# Altium project 100885_project.prjpcb
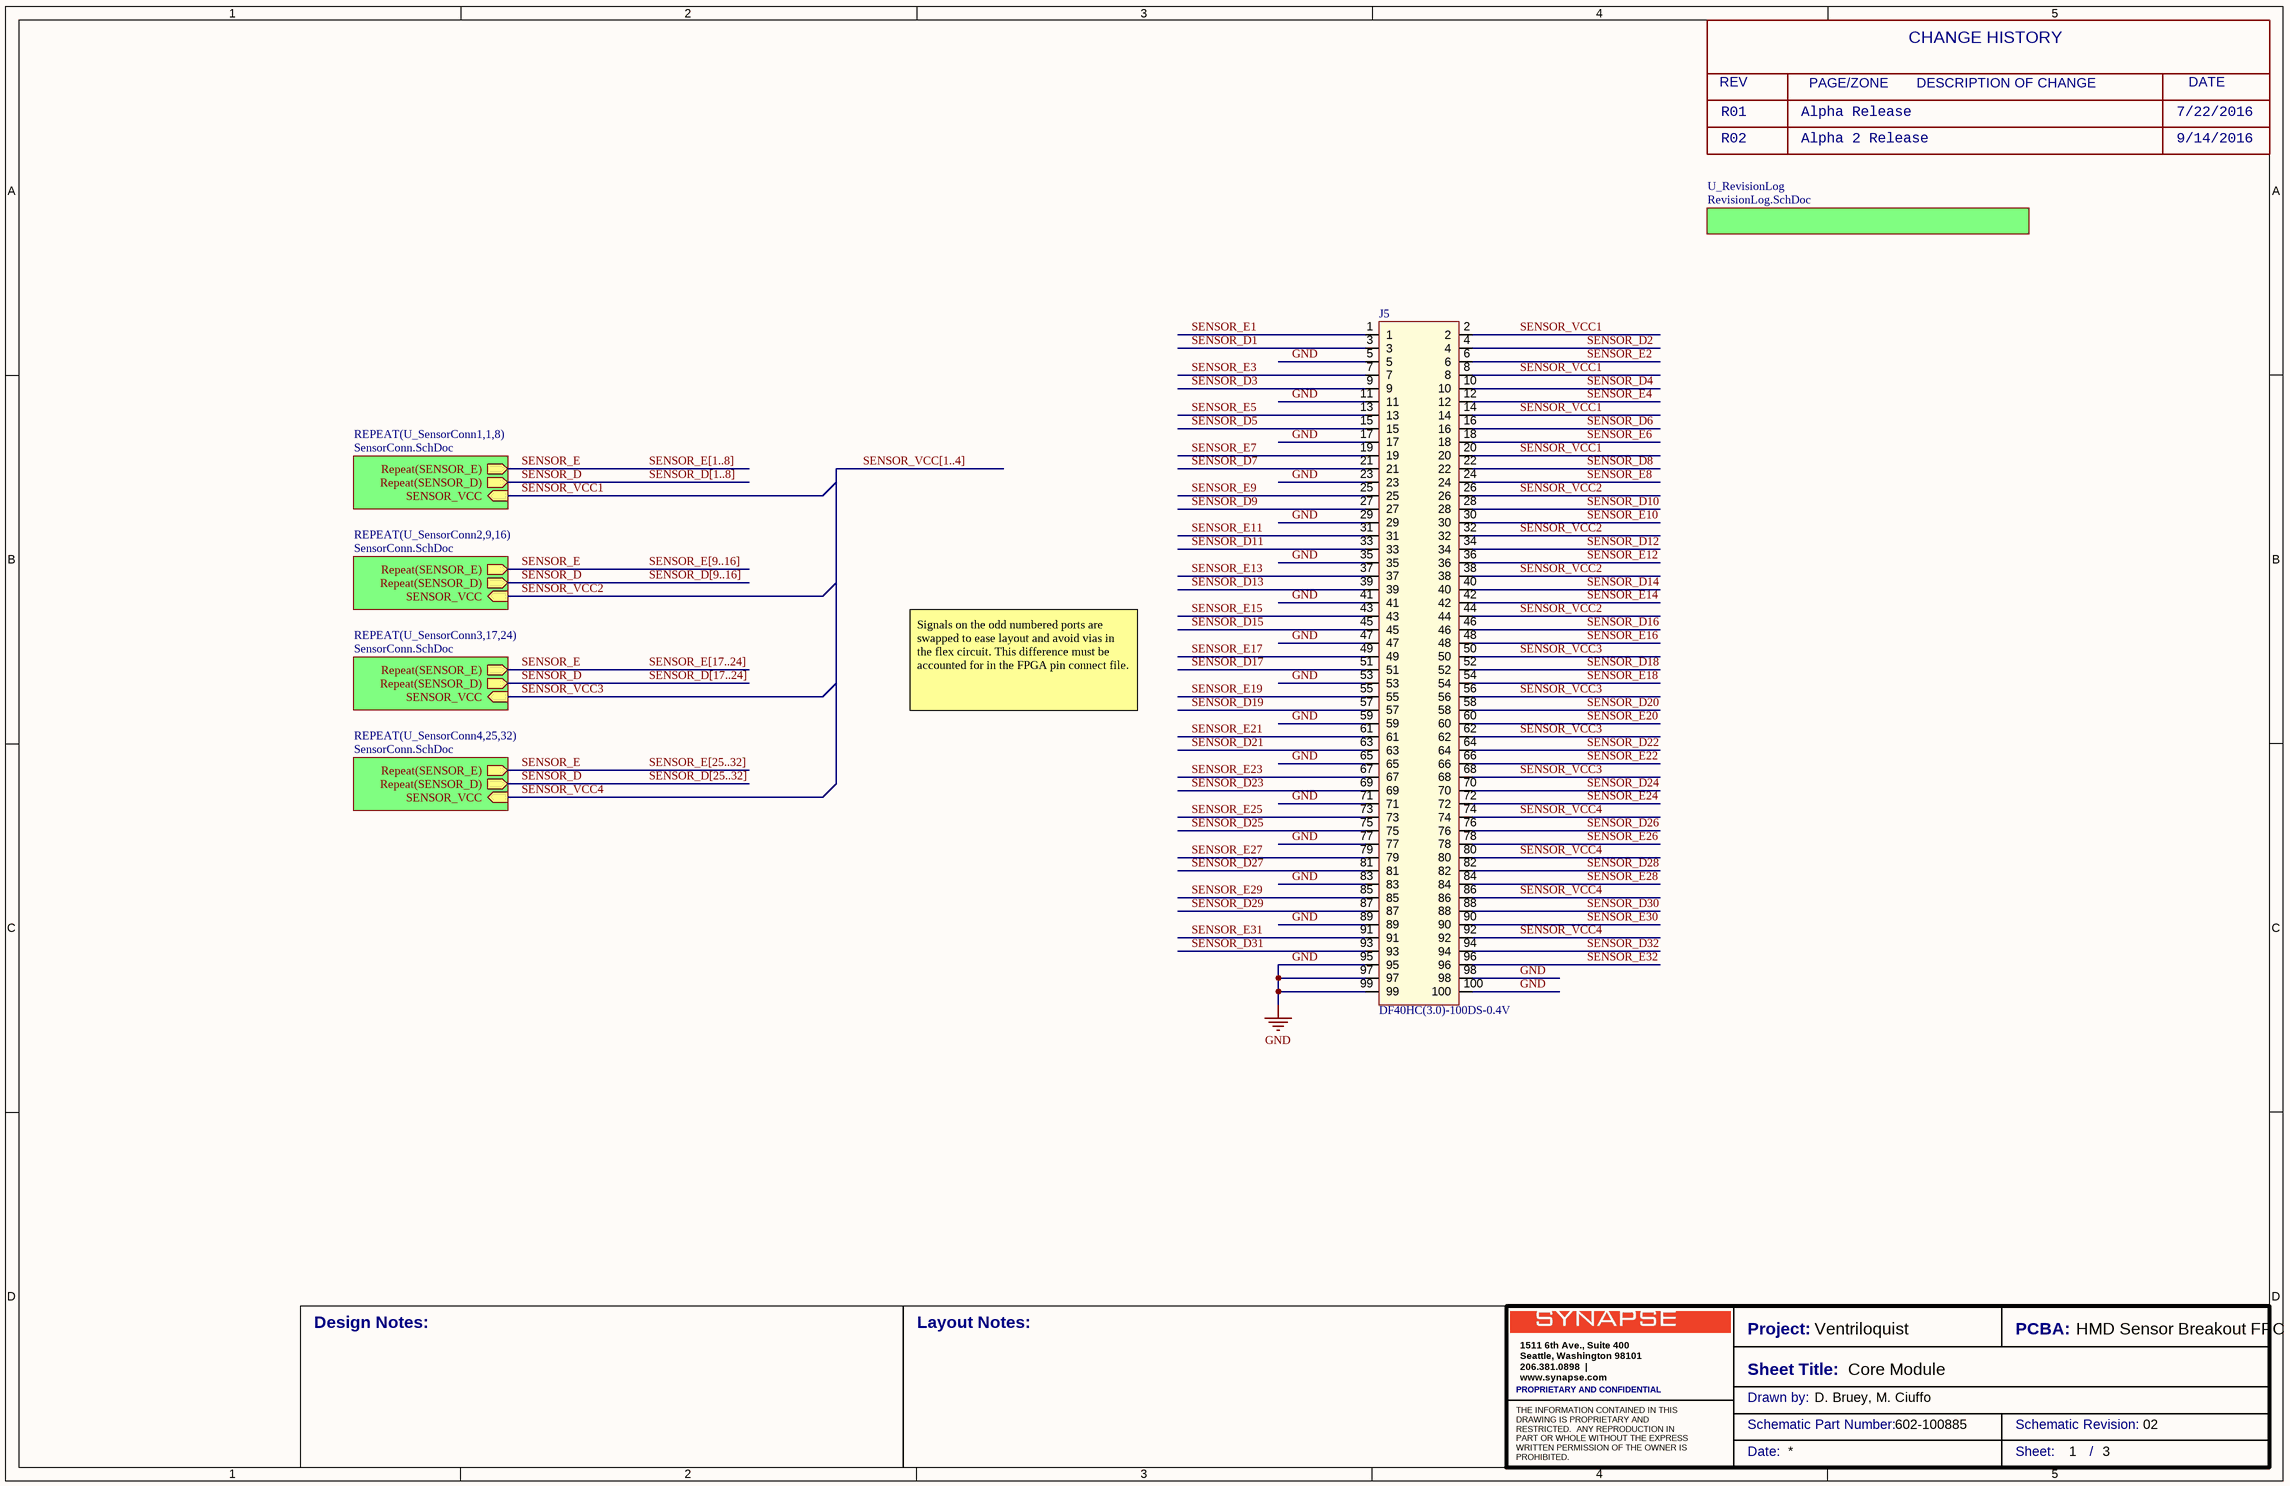
[diagram p0: SensorBreakout.SchDoc]
Sch_Revision: 02; Project_Name: Ventriloquist; PCB_Revision: 02; Board_Number: 100885; Board_Name: HMD Sensor Breakout FPC
3 sheets, 33 parts. Net scope: hierarchical (ports join the sheet entries above them; power ports are global).
Board file: 100885.PcbDoc
Sheets:
  SensorBreakout.SchDoc
    U_SensorConn11 = SensorConn.SchDoc
    U_SensorConn12 = SensorConn.SchDoc
    U_SensorConn13 = SensorConn.SchDoc
    U_SensorConn14 = SensorConn.SchDoc
    U_SensorConn15 = SensorConn.SchDoc
    U_SensorConn16 = SensorConn.SchDoc
    U_SensorConn17 = SensorConn.SchDoc
    U_SensorConn18 = SensorConn.SchDoc
    U_SensorConn29 = SensorConn.SchDoc
    U_SensorConn210 = SensorConn.SchDoc
    U_SensorConn211 = SensorConn.SchDoc
    U_SensorConn212 = SensorConn.SchDoc
    U_SensorConn213 = SensorConn.SchDoc
    U_SensorConn214 = SensorConn.SchDoc
    U_SensorConn215 = SensorConn.SchDoc
    U_SensorConn216 = SensorConn.SchDoc
    U_SensorConn317 = SensorConn.SchDoc
    U_SensorConn318 = SensorConn.SchDoc
    U_SensorConn319 = SensorConn.SchDoc
    U_SensorConn320 = SensorConn.SchDoc
    U_SensorConn321 = SensorConn.SchDoc
    U_SensorConn322 = SensorConn.SchDoc
    U_SensorConn323 = SensorConn.SchDoc
    U_SensorConn324 = SensorConn.SchDoc
    U_SensorConn425 = SensorConn.SchDoc
    U_SensorConn426 = SensorConn.SchDoc
    U_SensorConn427 = SensorConn.SchDoc
    U_SensorConn428 = SensorConn.SchDoc
    U_SensorConn429 = SensorConn.SchDoc
    U_SensorConn430 = SensorConn.SchDoc
    U_SensorConn431 = SensorConn.SchDoc
    U_SensorConn432 = SensorConn.SchDoc
    U_RevisionLog = RevisionLog.SchDoc

## Sheet SensorBreakout.SchDoc: Core Module
size 431 x 279 mm; DrawnBy: D. Bruey, M. Ciuffo; Organization: Synapse Product Development, LLC.; Address1: 1511 6th Ave., Suite 400; Address2: Seattle, Washington 98101; Address3: 206.381.0898; Address4: www.synapse.com; DocumentNumber: 1; SheetNumber: 1; SheetTotal: 3; PageSetup: Record=PageOptions|CenterHorizontal=True|CenterVertical=True|PrintScale=1.06|XCorrection=1.00|YCorrection=1.00|PrintKind=1|BorderSize=5000000|LeftOffset=0|BottomOffset=0|Orientation=2|PaperLength=4318|PaperWidth=2794|Scale=100|PaperSource=7|PrintQuality=200|MediaType=1|DitherType=10|PrintScaleMode=1|PaperKind=11x17|PaperIndex=3

### Parts
J5  DF40HC(3.0)-100DS-0.4V  [con100_hirose-df40c-100ds_129h]

### Sub-sheets
REPEAT(U_SensorConn1,1,8) = SensorConn.SchDoc: Repeat(SENSOR_D), Repeat(SENSOR_E), SENSOR_VCC (in)
REPEAT(U_SensorConn2,9,16) = SensorConn.SchDoc: Repeat(SENSOR_D), Repeat(SENSOR_E), SENSOR_VCC (in)
REPEAT(U_SensorConn3,17,24) = SensorConn.SchDoc: Repeat(SENSOR_D), Repeat(SENSOR_E), SENSOR_VCC (in)
REPEAT(U_SensorConn4,25,32) = SensorConn.SchDoc: Repeat(SENSOR_D), Repeat(SENSOR_E), SENSOR_VCC (in)
U_RevisionLog = RevisionLog.SchDoc: no entries

### Nets
GND: J5.5 J5.11 J5.17 J5.23 J5.29 J5.35 J5.41 J5.47 J5.53 J5.59 J5.65 J5.71 J5.77 J5.83 J5.89 J5.95 J5.97 J5.98 J5.99 J5.100
SENSOR_D: sheet REPEAT(U_SensorConn1,1,8)/Repeat(SENSOR_D), sheet REPEAT(U_SensorConn2,9,16)/Repeat(SENSOR_D), sheet REPEAT(U_SensorConn3,17,24)/Repeat(SENSOR_D), sheet REPEAT(U_SensorConn4,25,32)/Repeat(SENSOR_D)
SENSOR_D1: J5.3
SENSOR_D2: J5.4
SENSOR_D3: J5.9
SENSOR_D4: J5.10
SENSOR_D5: J5.15
SENSOR_D6: J5.16
SENSOR_D7: J5.21
SENSOR_D8: J5.22
SENSOR_D9: J5.27
SENSOR_D10: J5.28
SENSOR_D11: J5.33
SENSOR_D12: J5.34
SENSOR_D13: J5.39
SENSOR_D14: J5.40
SENSOR_D15: J5.45
SENSOR_D16: J5.46
SENSOR_D17: J5.51
SENSOR_D18: J5.52
SENSOR_D19: J5.57
SENSOR_D20: J5.58
SENSOR_D21: J5.63
SENSOR_D22: J5.64
SENSOR_D23: J5.69
SENSOR_D24: J5.70
SENSOR_D25: J5.75
SENSOR_D26: J5.76
SENSOR_D27: J5.81
SENSOR_D28: J5.82
SENSOR_D29: J5.87
SENSOR_D30: J5.88
SENSOR_D31: J5.93
SENSOR_D32: J5.94
SENSOR_E: sheet REPEAT(U_SensorConn1,1,8)/Repeat(SENSOR_E), sheet REPEAT(U_SensorConn2,9,16)/Repeat(SENSOR_E), sheet REPEAT(U_SensorConn3,17,24)/Repeat(SENSOR_E), sheet REPEAT(U_SensorConn4,25,32)/Repeat(SENSOR_E)
SENSOR_E1: J5.1
SENSOR_E2: J5.6
SENSOR_E3: J5.7
SENSOR_E4: J5.12
SENSOR_E5: J5.13
SENSOR_E6: J5.18
SENSOR_E7: J5.19
SENSOR_E8: J5.24
SENSOR_E9: J5.25
SENSOR_E10: J5.30
SENSOR_E11: J5.31
SENSOR_E12: J5.36
SENSOR_E13: J5.37
SENSOR_E14: J5.42
SENSOR_E15: J5.43
SENSOR_E16: J5.48
SENSOR_E17: J5.49
SENSOR_E18: J5.54
SENSOR_E19: J5.55
SENSOR_E20: J5.60
SENSOR_E21: J5.61
SENSOR_E22: J5.66
SENSOR_E23: J5.67
SENSOR_E24: J5.72
SENSOR_E25: J5.73
SENSOR_E26: J5.78
SENSOR_E27: J5.79
SENSOR_E28: J5.84
SENSOR_E29: J5.85
SENSOR_E30: J5.90
SENSOR_E31: J5.91
SENSOR_E32: J5.96
SENSOR_VCC1: J5.2 J5.8 J5.14 J5.20 ; sheet REPEAT(U_SensorConn1,1,8)/SENSOR_VCC
SENSOR_VCC2: J5.26 J5.32 J5.38 J5.44 ; sheet REPEAT(U_SensorConn2,9,16)/SENSOR_VCC
SENSOR_VCC3: J5.50 J5.56 J5.62 J5.68 ; sheet REPEAT(U_SensorConn3,17,24)/SENSOR_VCC
SENSOR_VCC4: J5.74 J5.80 J5.86 J5.92 ; sheet REPEAT(U_SensorConn4,25,32)/SENSOR_VCC

### Buses and harness runs
bus SENSOR_D[1..8]
bus SENSOR_D[9..16]
bus SENSOR_D[17..24]
bus SENSOR_D[25..32]
bus SENSOR_E[1..8]
bus SENSOR_E[9..16]
bus SENSOR_E[17..24]
bus SENSOR_E[25..32]
bus SENSOR_VCC[1..4]

### Notes on the sheet
- REV
- PAGE/ZONE       DESCRIPTION OF CHANGE
- CHANGE HISTORY
- DATE
- R01
- R02
- Alpha Release
- Alpha 2 Release
- 7/22/2016
- 9/14/2016
- Signals on the odd numbered ports are swapped to ease layout and avoid vias in the flex circuit. This difference must be accounted for in the FPGA pin connect file.
- Design Notes:
- Layout Notes:
- Project:
- Sheet Title:
- PCBA:
- PROPRIETARY AND CONFIDENTIAL
- Drawn by:
- Schematic Part Number:
- Schematic Revision:
- Date:
- Sheet:
- /

### Library data of the parts
J5 = DF40HC(3.0)-100DS-0.4V(51): CONN RCPT 100POS 0.4MM SMD GOLD 3.0MM; part_type: connector; id: 1590; mfg: Hirose; dist: Mouser; dist_pn: 798-DF40HC30100DS451; voltage: 30V; positions: 100; TableName: viewAltiumConnectors; mfg_pn: DF40HC(3.0)-100DS-0.4V(51); source_package: DF40HC(3.0)-100DS-0.4V(51); height: 3.0mm; status: Unknown; datasheet: http://www.hirose.co.jp/cataloge_hp/ed_DF40_20140305.pdf

## Sheet SensorConn.SchDoc: Sensor Connectors
size 431 x 279 mm; DrawnBy: D. Bruey, M. Ciuffo; Organization: Synapse Product Development, LLC.; Address1: 1511 6th Ave., Suite 400; Address2: Seattle, Washington 98101; Address3: 206.381.0898; Address4: www.synapse.com; DocumentNumber: 2; SheetNumber: 2; SheetTotal: 3; PageSetup: Record=PageOptions|CenterHorizontal=True|CenterVertical=True|PrintScale=1.06|XCorrection=1.00|YCorrection=1.00|PrintKind=1|BorderSize=5000000|LeftOffset=0|BottomOffset=0|Orientation=2|PaperLength=4318|PaperWidth=2794|Scale=100|PaperSource=7|PrintQuality=200|MediaType=1|DitherType=10|PrintScaleMode=1|PaperKind=11x17|PaperIndex=3
Used 32 times, as channels U_SensorConn11, U_SensorConn12, U_SensorConn13, U_SensorConn14, U_SensorConn15, U_SensorConn16, U_SensorConn17, U_SensorConn18, U_SensorConn29, U_SensorConn210, U_SensorConn211, U_SensorConn212, U_SensorConn213, U_SensorConn214, U_SensorConn215, U_SensorConn216, U_SensorConn317, U_SensorConn318, U_SensorConn319, U_SensorConn320, U_SensorConn321, U_SensorConn322, U_SensorConn323, U_SensorConn324, U_SensorConn425, U_SensorConn426, U_SensorConn427, U_SensorConn428, U_SensorConn429, U_SensorConn430, U_SensorConn431, U_SensorConn432. Parts and nets are listed once, with the designators drawn on the sheet.
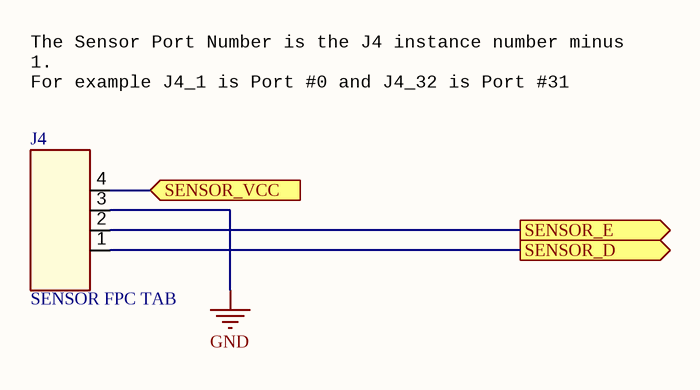
[diagram p1: SensorConn.SchDoc]

### Parts
J4  SENSOR FPC TAB  [WATCHMAN_CUSTOM_ZIF_4_PADS]  (no BOM)

### Ports
SENSOR_D (out), SENSOR_E (out), SENSOR_VCC (in)

### Nets
GND: J4.3
SENSOR_D: J4.1 ; port SENSOR_D
SENSOR_E: J4.2 ; port SENSOR_E
SENSOR_VCC: J4.4 ; port SENSOR_VCC

### Channels
U_SensorConn11: designators end in _1; ports SENSOR_D=SENSOR_D1 SENSOR_E=SENSOR_E1 SENSOR_VCC=SENSOR_VCC1
U_SensorConn12: designators end in _2; ports SENSOR_D=SENSOR_D2 SENSOR_E=SENSOR_E2 SENSOR_VCC=SENSOR_VCC1
U_SensorConn13: designators end in _3; ports SENSOR_D=SENSOR_D3 SENSOR_E=SENSOR_E3 SENSOR_VCC=SENSOR_VCC1
U_SensorConn14: designators end in _4; ports SENSOR_D=SENSOR_D4 SENSOR_E=SENSOR_E4 SENSOR_VCC=SENSOR_VCC1
U_SensorConn15: designators end in _5; ports SENSOR_D=SENSOR_D5 SENSOR_E=SENSOR_E5 SENSOR_VCC=SENSOR_VCC1
U_SensorConn16: designators end in _6; ports SENSOR_D=SENSOR_D6 SENSOR_E=SENSOR_E6 SENSOR_VCC=SENSOR_VCC1
U_SensorConn17: designators end in _7; ports SENSOR_D=SENSOR_D7 SENSOR_E=SENSOR_E7 SENSOR_VCC=SENSOR_VCC1
U_SensorConn18: designators end in _8; ports SENSOR_D=SENSOR_D8 SENSOR_E=SENSOR_E8 SENSOR_VCC=SENSOR_VCC1
U_SensorConn29: designators end in _9; ports SENSOR_D=SENSOR_D9 SENSOR_E=SENSOR_E9 SENSOR_VCC=SENSOR_VCC2
U_SensorConn210: designators end in _10; ports SENSOR_D=SENSOR_D10 SENSOR_E=SENSOR_E10 SENSOR_VCC=SENSOR_VCC2
U_SensorConn211: designators end in _11; ports SENSOR_D=SENSOR_D11 SENSOR_E=SENSOR_E11 SENSOR_VCC=SENSOR_VCC2
U_SensorConn212: designators end in _12; ports SENSOR_D=SENSOR_D12 SENSOR_E=SENSOR_E12 SENSOR_VCC=SENSOR_VCC2
U_SensorConn213: designators end in _13; ports SENSOR_D=SENSOR_D13 SENSOR_E=SENSOR_E13 SENSOR_VCC=SENSOR_VCC2
U_SensorConn214: designators end in _14; ports SENSOR_D=SENSOR_D14 SENSOR_E=SENSOR_E14 SENSOR_VCC=SENSOR_VCC2
U_SensorConn215: designators end in _15; ports SENSOR_D=SENSOR_D15 SENSOR_E=SENSOR_E15 SENSOR_VCC=SENSOR_VCC2
U_SensorConn216: designators end in _16; ports SENSOR_D=SENSOR_D16 SENSOR_E=SENSOR_E16 SENSOR_VCC=SENSOR_VCC2
U_SensorConn317: designators end in _17; ports SENSOR_D=SENSOR_D17 SENSOR_E=SENSOR_E17 SENSOR_VCC=SENSOR_VCC3
U_SensorConn318: designators end in _18; ports SENSOR_D=SENSOR_D18 SENSOR_E=SENSOR_E18 SENSOR_VCC=SENSOR_VCC3
U_SensorConn319: designators end in _19; ports SENSOR_D=SENSOR_D19 SENSOR_E=SENSOR_E19 SENSOR_VCC=SENSOR_VCC3
U_SensorConn320: designators end in _20; ports SENSOR_D=SENSOR_D20 SENSOR_E=SENSOR_E20 SENSOR_VCC=SENSOR_VCC3
U_SensorConn321: designators end in _21; ports SENSOR_D=SENSOR_D21 SENSOR_E=SENSOR_E21 SENSOR_VCC=SENSOR_VCC3
U_SensorConn322: designators end in _22; ports SENSOR_D=SENSOR_D22 SENSOR_E=SENSOR_E22 SENSOR_VCC=SENSOR_VCC3
U_SensorConn323: designators end in _23; ports SENSOR_D=SENSOR_D23 SENSOR_E=SENSOR_E23 SENSOR_VCC=SENSOR_VCC3
U_SensorConn324: designators end in _24; ports SENSOR_D=SENSOR_D24 SENSOR_E=SENSOR_E24 SENSOR_VCC=SENSOR_VCC3
U_SensorConn425: designators end in _25; ports SENSOR_D=SENSOR_D25 SENSOR_E=SENSOR_E25 SENSOR_VCC=SENSOR_VCC4
U_SensorConn426: designators end in _26; ports SENSOR_D=SENSOR_D26 SENSOR_E=SENSOR_E26 SENSOR_VCC=SENSOR_VCC4
U_SensorConn427: designators end in _27; ports SENSOR_D=SENSOR_D27 SENSOR_E=SENSOR_E27 SENSOR_VCC=SENSOR_VCC4
U_SensorConn428: designators end in _28; ports SENSOR_D=SENSOR_D28 SENSOR_E=SENSOR_E28 SENSOR_VCC=SENSOR_VCC4
U_SensorConn429: designators end in _29; ports SENSOR_D=SENSOR_D29 SENSOR_E=SENSOR_E29 SENSOR_VCC=SENSOR_VCC4
U_SensorConn430: designators end in _30; ports SENSOR_D=SENSOR_D30 SENSOR_E=SENSOR_E30 SENSOR_VCC=SENSOR_VCC4
U_SensorConn431: designators end in _31; ports SENSOR_D=SENSOR_D31 SENSOR_E=SENSOR_E31 SENSOR_VCC=SENSOR_VCC4
U_SensorConn432: designators end in _32; ports SENSOR_D=SENSOR_D32 SENSOR_E=SENSOR_E32 SENSOR_VCC=SENSOR_VCC4

### Notes on the sheet
- The Sensor Port Number is the J4 instance number minus 1.
  For example J4_1 is Port #0 and J4_32 is Port #31
- Design Notes:
- Layout Notes:
- Project:
- Sheet Title:
- PCBA:
- PROPRIETARY AND CONFIDENTIAL
- Drawn by:
- Schematic Part Number:
- Schematic Revision:
- Date:
- Sheet:
- /

### Library data of the parts
J4 = Watchman_Sensor_FPC_Tab: WATCHMAN SENSOR FPC TABS; part_type: connector; id: 1609; mfg: Custom; positions: 4; TableName: viewAltiumConnectors; mfg_pn: Watchman_Sensor_FPC_Tab; dist_pn: Watchman_Sensor_FPC_Tab; status: Unknown

## Sheet RevisionLog.SchDoc: Revision Log
size 431 x 279 mm; DrawnBy: D. Bruey, M. Ciuffo; Organization: Synapse Product Development, LLC.; Address1: 1511 6th Ave., Suite 400; Address2: Seattle, Washington 98101; Address3: 206.381.0898; Address4: www.synapse.com; DocumentNumber: 3; SheetNumber: 3; SheetTotal: 3; PageSetup: Record=PageOptions|CenterHorizontal=True|CenterVertical=True|PrintScale=1.06|XCorrection=1.00|YCorrection=1.00|PrintKind=1|BorderSize=5000000|LeftOffset=0|BottomOffset=0|Orientation=2|PaperLength=4318|PaperWidth=2794|Scale=100|PaperSource=7|PrintQuality=200|MediaType=1|DitherType=10|PrintScaleMode=1|PaperKind=11x17|PaperIndex=3
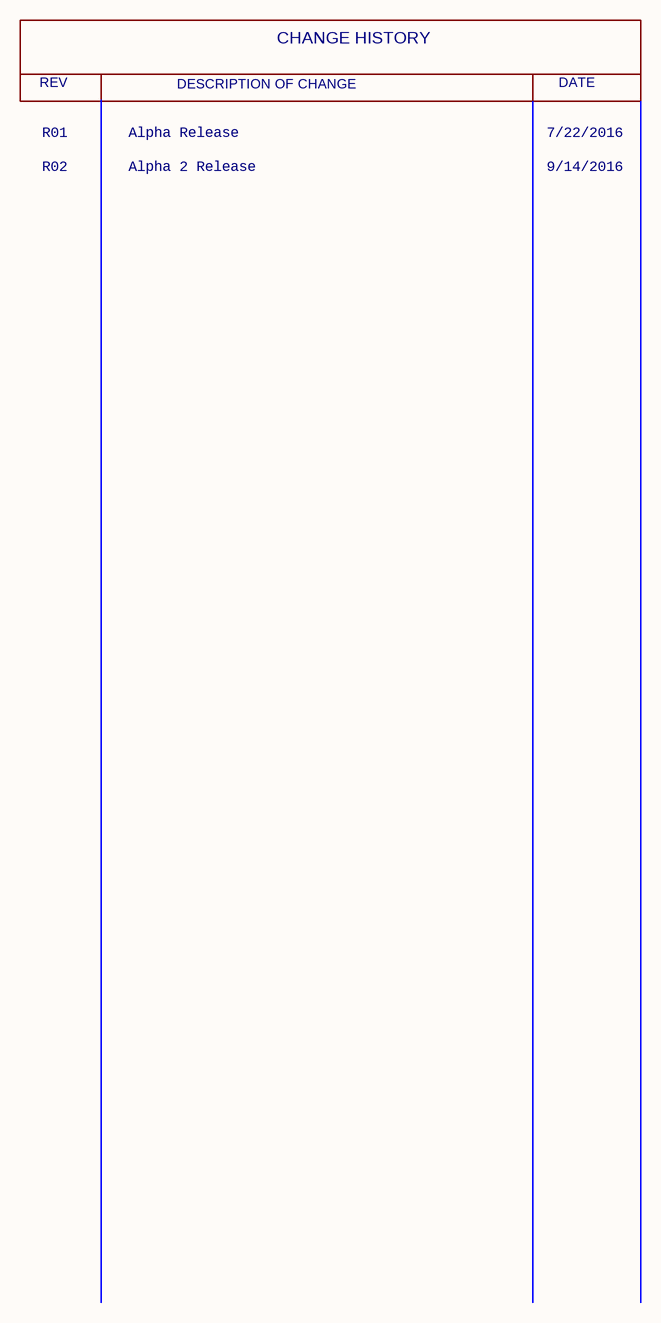
[diagram p2: RevisionLog.SchDoc]

### Notes on the sheet
- REV
- DESCRIPTION OF CHANGE
- CHANGE HISTORY
- DATE
- R01
- R02
- Alpha Release
- Alpha 2 Release
- 7/22/2016
- 9/14/2016
- Design Notes:
- Layout Notes:
- Project:
- Sheet Title:
- PCBA:
- PROPRIETARY AND CONFIDENTIAL
- Drawn by:
- Schematic Part Number:
- Schematic Revision:
- Date:
- Sheet:
- /

## Nets that join several sheets
GND: SensorBreakout (20 pins), U_SensorConn11 (J4_1.3), U_SensorConn12 (J4_2.3), U_SensorConn13 (J4_3.3), U_SensorConn14 (J4_4.3), U_SensorConn15 (J4_5.3), U_SensorConn16 (J4_6.3), U_SensorConn17 (J4_7.3), U_SensorConn18 (J4_8.3), U_SensorConn29 (J4_9.3), U_SensorConn210 (J4_10.3), U_SensorConn211 (J4_11.3), U_SensorConn212 (J4_12.3), U_SensorConn213 (J4_13.3), U_SensorConn214 (J4_14.3), U_SensorConn215 (J4_15.3), U_SensorConn216 (J4_16.3), U_SensorConn317 (J4_17.3), U_SensorConn318 (J4_18.3), U_SensorConn319 (J4_19.3), U_SensorConn320 (J4_20.3), U_SensorConn321 (J4_21.3), U_SensorConn322 (J4_22.3), U_SensorConn323 (J4_23.3), U_SensorConn324 (J4_24.3), U_SensorConn425 (J4_25.3), U_SensorConn426 (J4_26.3), U_SensorConn427 (J4_27.3), U_SensorConn428 (J4_28.3), U_SensorConn429 (J4_29.3), U_SensorConn430 (J4_30.3), U_SensorConn431 (J4_31.3), U_SensorConn432 (J4_32.3)
SENSOR_D1: SensorBreakout (J5.3), U_SensorConn11 (J4_1.1)
SENSOR_D2: SensorBreakout (J5.4), U_SensorConn12 (J4_2.1)
SENSOR_D3: SensorBreakout (J5.9), U_SensorConn13 (J4_3.1)
SENSOR_D4: SensorBreakout (J5.10), U_SensorConn14 (J4_4.1)
SENSOR_D5: SensorBreakout (J5.15), U_SensorConn15 (J4_5.1)
SENSOR_D6: SensorBreakout (J5.16), U_SensorConn16 (J4_6.1)
SENSOR_D7: SensorBreakout (J5.21), U_SensorConn17 (J4_7.1)
SENSOR_D8: SensorBreakout (J5.22), U_SensorConn18 (J4_8.1)
SENSOR_D9: SensorBreakout (J5.27), U_SensorConn29 (J4_9.1)
SENSOR_D10: SensorBreakout (J5.28), U_SensorConn210 (J4_10.1)
SENSOR_D11: SensorBreakout (J5.33), U_SensorConn211 (J4_11.1)
SENSOR_D12: SensorBreakout (J5.34), U_SensorConn212 (J4_12.1)
SENSOR_D13: SensorBreakout (J5.39), U_SensorConn213 (J4_13.1)
SENSOR_D14: SensorBreakout (J5.40), U_SensorConn214 (J4_14.1)
SENSOR_D15: SensorBreakout (J5.45), U_SensorConn215 (J4_15.1)
SENSOR_D16: SensorBreakout (J5.46), U_SensorConn216 (J4_16.1)
SENSOR_D17: SensorBreakout (J5.51), U_SensorConn317 (J4_17.1)
SENSOR_D18: SensorBreakout (J5.52), U_SensorConn318 (J4_18.1)
SENSOR_D19: SensorBreakout (J5.57), U_SensorConn319 (J4_19.1)
SENSOR_D20: SensorBreakout (J5.58), U_SensorConn320 (J4_20.1)
SENSOR_D21: SensorBreakout (J5.63), U_SensorConn321 (J4_21.1)
SENSOR_D22: SensorBreakout (J5.64), U_SensorConn322 (J4_22.1)
SENSOR_D23: SensorBreakout (J5.69), U_SensorConn323 (J4_23.1)
SENSOR_D24: SensorBreakout (J5.70), U_SensorConn324 (J4_24.1)
SENSOR_D25: SensorBreakout (J5.75), U_SensorConn425 (J4_25.1)
SENSOR_D26: SensorBreakout (J5.76), U_SensorConn426 (J4_26.1)
SENSOR_D27: SensorBreakout (J5.81), U_SensorConn427 (J4_27.1)
SENSOR_D28: SensorBreakout (J5.82), U_SensorConn428 (J4_28.1)
SENSOR_D29: SensorBreakout (J5.87), U_SensorConn429 (J4_29.1)
SENSOR_D30: SensorBreakout (J5.88), U_SensorConn430 (J4_30.1)
SENSOR_D31: SensorBreakout (J5.93), U_SensorConn431 (J4_31.1)
SENSOR_D32: SensorBreakout (J5.94), U_SensorConn432 (J4_32.1)
SENSOR_E1: SensorBreakout (J5.1), U_SensorConn11 (J4_1.2)
SENSOR_E2: SensorBreakout (J5.6), U_SensorConn12 (J4_2.2)
SENSOR_E3: SensorBreakout (J5.7), U_SensorConn13 (J4_3.2)
SENSOR_E4: SensorBreakout (J5.12), U_SensorConn14 (J4_4.2)
SENSOR_E5: SensorBreakout (J5.13), U_SensorConn15 (J4_5.2)
SENSOR_E6: SensorBreakout (J5.18), U_SensorConn16 (J4_6.2)
SENSOR_E7: SensorBreakout (J5.19), U_SensorConn17 (J4_7.2)
SENSOR_E8: SensorBreakout (J5.24), U_SensorConn18 (J4_8.2)
SENSOR_E9: SensorBreakout (J5.25), U_SensorConn29 (J4_9.2)
SENSOR_E10: SensorBreakout (J5.30), U_SensorConn210 (J4_10.2)
SENSOR_E11: SensorBreakout (J5.31), U_SensorConn211 (J4_11.2)
SENSOR_E12: SensorBreakout (J5.36), U_SensorConn212 (J4_12.2)
SENSOR_E13: SensorBreakout (J5.37), U_SensorConn213 (J4_13.2)
SENSOR_E14: SensorBreakout (J5.42), U_SensorConn214 (J4_14.2)
SENSOR_E15: SensorBreakout (J5.43), U_SensorConn215 (J4_15.2)
SENSOR_E16: SensorBreakout (J5.48), U_SensorConn216 (J4_16.2)
SENSOR_E17: SensorBreakout (J5.49), U_SensorConn317 (J4_17.2)
SENSOR_E18: SensorBreakout (J5.54), U_SensorConn318 (J4_18.2)
SENSOR_E19: SensorBreakout (J5.55), U_SensorConn319 (J4_19.2)
SENSOR_E20: SensorBreakout (J5.60), U_SensorConn320 (J4_20.2)
SENSOR_E21: SensorBreakout (J5.61), U_SensorConn321 (J4_21.2)
SENSOR_E22: SensorBreakout (J5.66), U_SensorConn322 (J4_22.2)
SENSOR_E23: SensorBreakout (J5.67), U_SensorConn323 (J4_23.2)
SENSOR_E24: SensorBreakout (J5.72), U_SensorConn324 (J4_24.2)
SENSOR_E25: SensorBreakout (J5.73), U_SensorConn425 (J4_25.2)
SENSOR_E26: SensorBreakout (J5.78), U_SensorConn426 (J4_26.2)
SENSOR_E27: SensorBreakout (J5.79), U_SensorConn427 (J4_27.2)
SENSOR_E28: SensorBreakout (J5.84), U_SensorConn428 (J4_28.2)
SENSOR_E29: SensorBreakout (J5.85), U_SensorConn429 (J4_29.2)
SENSOR_E30: SensorBreakout (J5.90), U_SensorConn430 (J4_30.2)
SENSOR_E31: SensorBreakout (J5.91), U_SensorConn431 (J4_31.2)
SENSOR_E32: SensorBreakout (J5.96), U_SensorConn432 (J4_32.2)
SENSOR_VCC1: SensorBreakout (J5.2 J5.8 J5.14 J5.20), U_SensorConn11 (J4_1.4), U_SensorConn12 (J4_2.4), U_SensorConn13 (J4_3.4), U_SensorConn14 (J4_4.4), U_SensorConn15 (J4_5.4), U_SensorConn16 (J4_6.4), U_SensorConn17 (J4_7.4), U_SensorConn18 (J4_8.4)
SENSOR_VCC2: SensorBreakout (J5.26 J5.32 J5.38 J5.44), U_SensorConn29 (J4_9.4), U_SensorConn210 (J4_10.4), U_SensorConn211 (J4_11.4), U_SensorConn212 (J4_12.4), U_SensorConn213 (J4_13.4), U_SensorConn214 (J4_14.4), U_SensorConn215 (J4_15.4), U_SensorConn216 (J4_16.4)
SENSOR_VCC3: SensorBreakout (J5.50 J5.56 J5.62 J5.68), U_SensorConn317 (J4_17.4), U_SensorConn318 (J4_18.4), U_SensorConn319 (J4_19.4), U_SensorConn320 (J4_20.4), U_SensorConn321 (J4_21.4), U_SensorConn322 (J4_22.4), U_SensorConn323 (J4_23.4), U_SensorConn324 (J4_24.4)
SENSOR_VCC4: SensorBreakout (J5.74 J5.80 J5.86 J5.92), U_SensorConn425 (J4_25.4), U_SensorConn426 (J4_26.4), U_SensorConn427 (J4_27.4), U_SensorConn428 (J4_28.4), U_SensorConn429 (J4_29.4), U_SensorConn430 (J4_30.4), U_SensorConn431 (J4_31.4), U_SensorConn432 (J4_32.4)

## Assembly variants
100885: all parts fitted